# EAGLE design voice boardv1 (EAGLE 6.1)
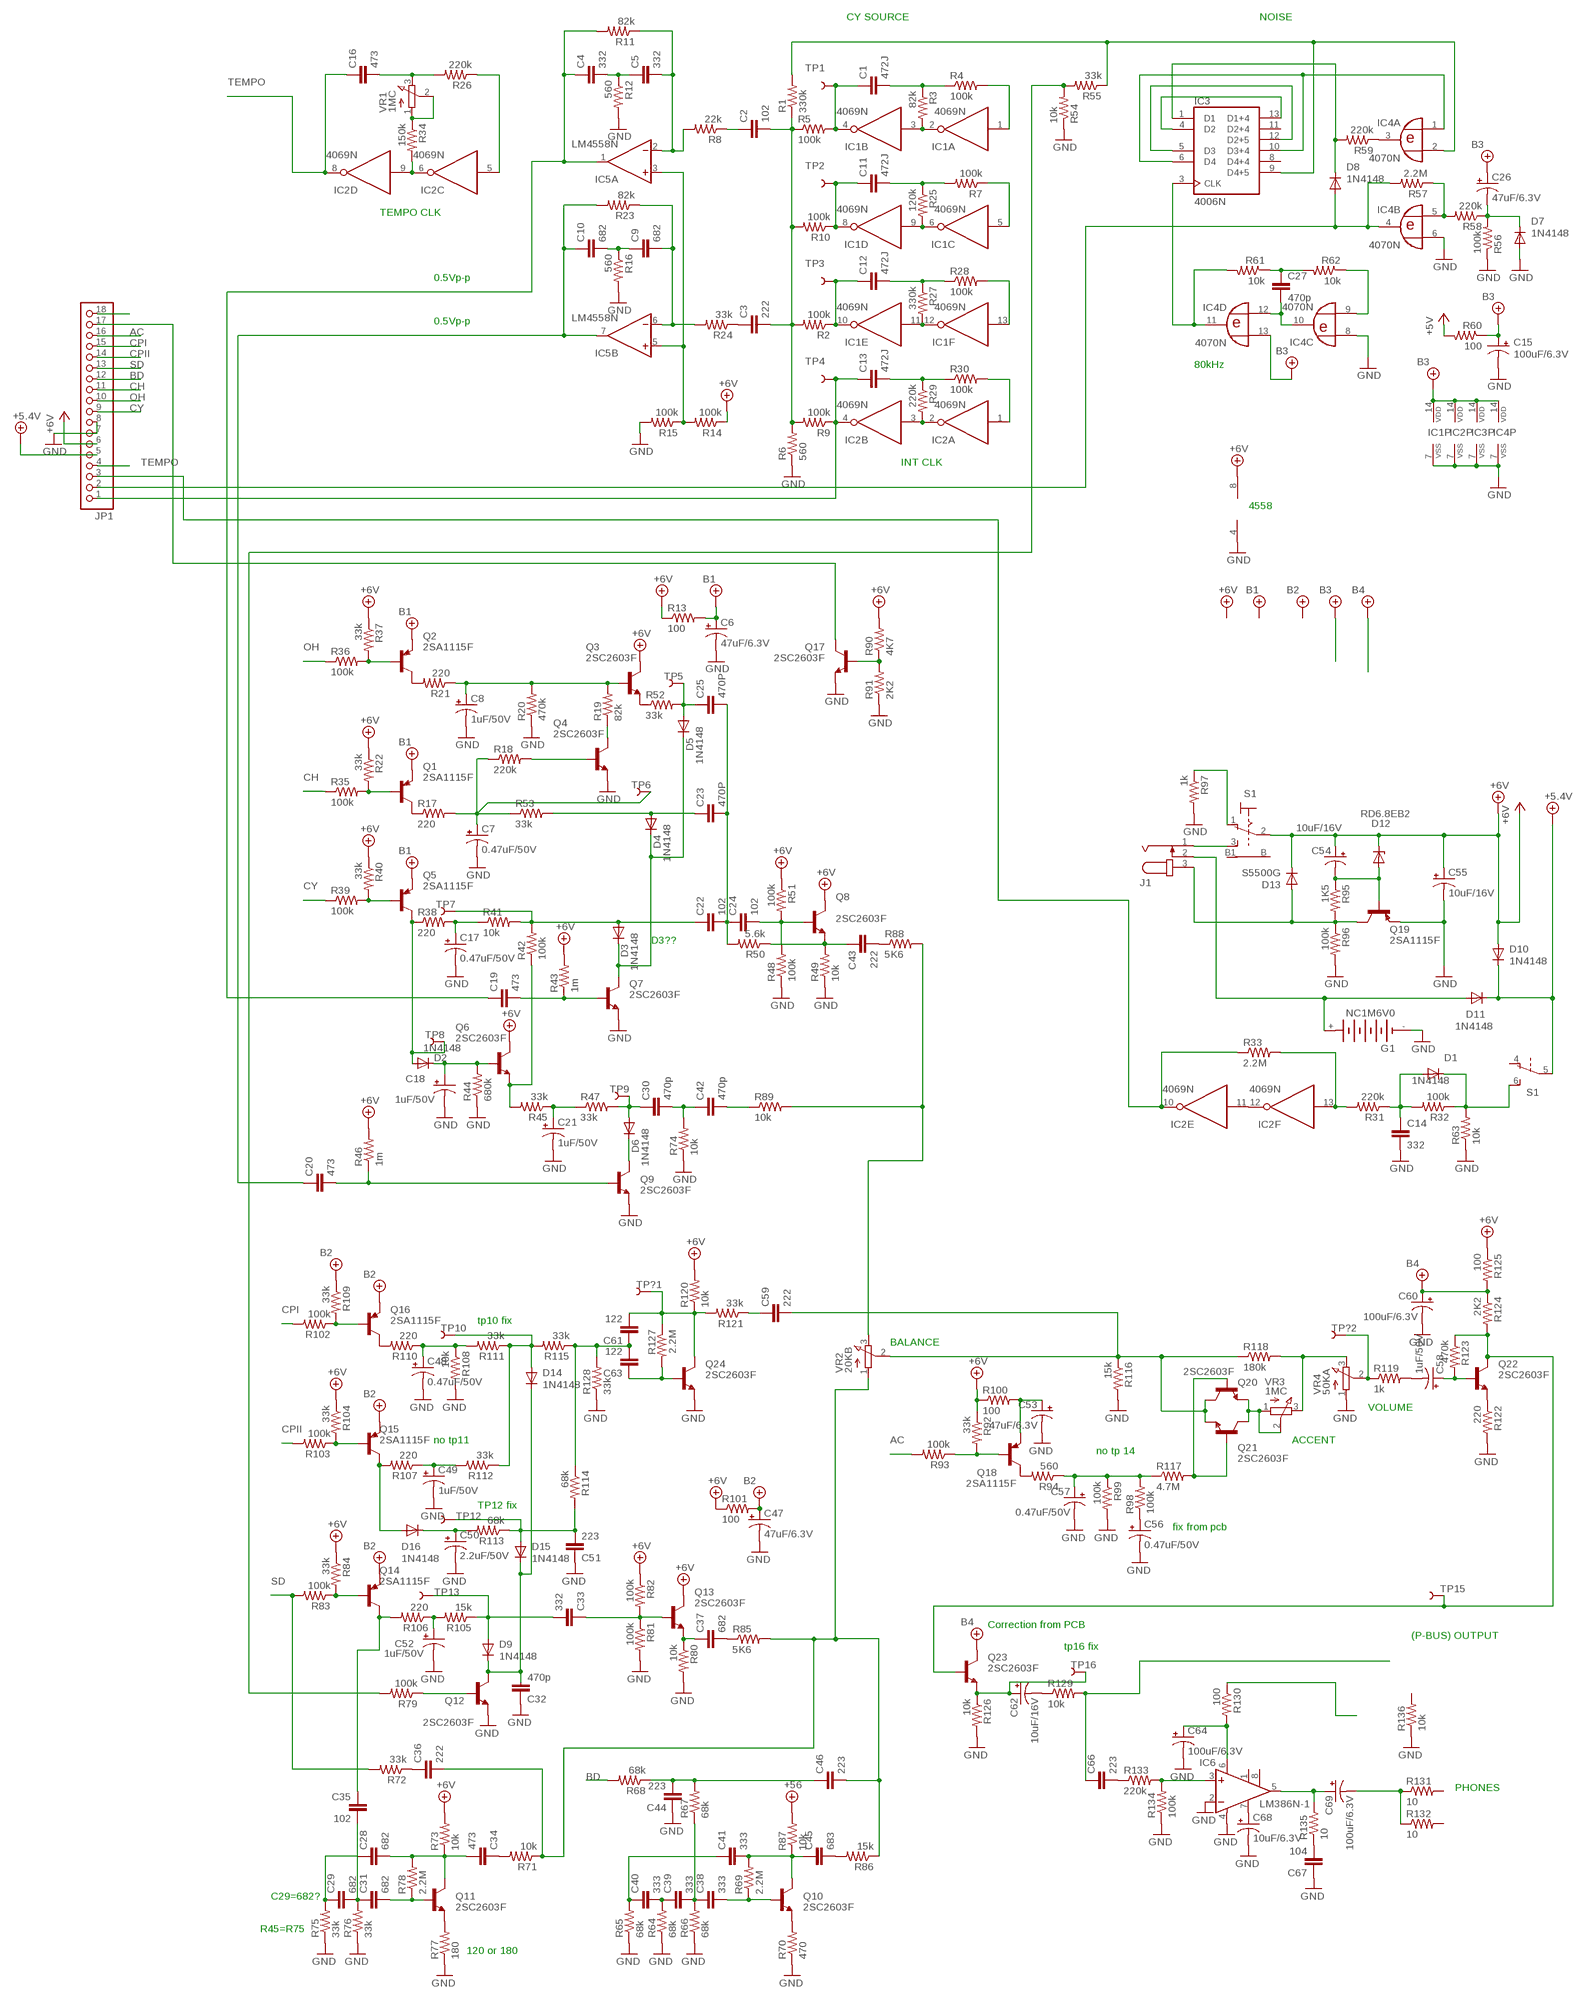
[diagram p0: schematic, sheet 1]

## Parts
C1  472J  C-EU050-024X044  [C050-024X044]
C2  102  C-EU050-024X044  [C050-024X044]
C3  222  C-EU050-024X044  [C050-024X044]
C4  332  C-EU050-024X044  [C050-024X044]
C5  332  C-EU050-024X044  [C050-024X044]
C6  47uF/6.3V  CPOL-USB45181B  [B45181B]
C7  0.47uF/50V  CPOL-USB45181B  [B45181B]
C8  1uF/50V  CPOL-USB45181B  [B45181B]
C9  682  C-EU050-024X044  [C050-024X044]
C10  682  C-EU050-024X044  [C050-024X044]
C11  472J  C-EU050-024X044  [C050-024X044]
C12  472J  C-EU050-024X044  [C050-024X044]
C13  472J  C-EU050-024X044  [C050-024X044]
C14  332  C-EU050-024X044  [C050-024X044]
C15  100uF/6.3V  CPOL-USB45181B  [B45181B]
C16  473  C-EU050-024X044  [C050-024X044]
C17  0.47uF/50V  CPOL-USB45181B  [B45181B]
C18  1uF/50V  CPOL-USB45181B  [B45181B]
C19  473  C-EU050-024X044  [C050-024X044]
C20  473  C-EU050-024X044  [C050-024X044]
C21  1uF/50V  CPOL-USB45181B  [B45181B]
C22  102  C-EU050-024X044  [C050-024X044]
C23  470P  C-EU050-024X044  [C050-024X044]
C24  102  C-EU050-024X044  [C050-024X044]
C25  470P  C-EU050-024X044  [C050-024X044]
C26  47uF/6.3V  CPOL-USB45181B  [B45181B]
C27  470p  C-EU050-024X044  [C050-024X044]
C28  682  C-EU050-024X044  [C050-024X044]
C29  682  C-EU050-024X044  [C050-024X044]
C30  470p  C-EU050-024X044  [C050-024X044]
C31  682  C-EU050-024X044  [C050-024X044]
C32  470p  C-EU050-024X044  [C050-024X044]
C33  332  C-EU050-024X044  [C050-024X044]
C34  473  C-EU050-024X044  [C050-024X044]
C35  102  C-EU050-024X044  [C050-024X044]
C36  222  C-EU050-024X044  [C050-024X044]
C37  682  C-EU050-024X044  [C050-024X044]
C38  333  C-EU050-024X044  [C050-024X044]
C39  333  C-EU050-024X044  [C050-024X044]
C40  333  C-EU050-024X044  [C050-024X044]
C41  333  C-EU050-024X044  [C050-024X044]
C42  470p  C-EU050-024X044  [C050-024X044]
C43  222  C-EU050-024X044  [C050-024X044]
C44  223  C-EU050-024X044  [C050-024X044]
C45  683  C-EU050-024X044  [C050-024X044]
C46  223  C-EU050-024X044  [C050-024X044]
C47  47uF/6.3V  CPOL-USB45181B  [B45181B]
C48  0.47uF/50V  CPOL-USB45181B  [B45181B]
C49  1uF/50V  CPOL-USB45181B  [B45181B]
C50  2.2uF/50V  CPOL-USB45181B  [B45181B]
C51  223  C-EU050-024X044  [C050-024X044]
C52  1uF/50V  CPOL-USB45181B  [B45181B]
C53  47uF/6.3V  CPOL-USB45181B  [B45181B]
C54  10uF/16V  CPOL-USB45181B  [B45181B]
C55  10uF/16V  CPOL-USB45181B  [B45181B]
C56  0.47uF/50V  CPOL-USB45181B  [B45181B]
C57  0.47uF/50V  CPOL-USB45181B  [B45181B]
C58  1uF/50V  CPOL-USB45181B  [B45181B]
C59  222  C-EU050-024X044  [C050-024X044]
C60  100uF/6.3V  CPOL-USB45181B  [B45181B]
C61  122  C-EU050-024X044  [C050-024X044]
C62  10uF/16V  CPOL-USB45181B  [B45181B]
C63  122  C-EU050-024X044  [C050-024X044]
C64  100uF/6.3V  CPOL-USB45181B  [B45181B]
C66  223  C-EU050-024X044  [C050-024X044]
C67  104  C-EU050-024X044  [C050-024X044]
C68  10uF/6.3V  CPOL-USB45181B  [B45181B]
C69  100uF/6.3V  CPOL-USB45181B  [B45181B]
D1  1N4148  DIODE-D-5  [D-5]
D2  1N4148  DIODE-D-5  [D-5]
D3  1N4148  DIODE-D-5  [D-5]
D4  1N4148  DIODE-D-5  [D-5]
D5  1N4148  DIODE-D-5  [D-5]
D6  1N4148  DIODE-D-5  [D-5]
D7  1N4148  DIODE-D-5  [D-5]
D8  1N4148  DIODE-D-5  [D-5]
D9  1N4148  DIODE-D-5  [D-5]
D10  1N4148  DIODE-D-5  [D-5]
D11  1N4148  DIODE-D-5  [D-5]
D12  RD6.8EB2  ZENER-DIODEZD-5  [ZDIO-5]
D13  S5500G  DIODE-D-5  [D-5]
D14  1N4148  DIODE-D-5  [D-5]
D15  1N4148  DIODE-D-5  [D-5]
D16  1N4148  DIODE-D-5  [D-5]
G1  NC1M6V0  [NC1M]
IC1  4069N  [DIL14]
IC2  4069N  [DIL14]
IC3  4006N  [DIL14]
IC4  4070N  [DIL14]
IC5  LM4558N  [DIL08]
IC6  LM386N-1  [DIL08]
J1  JACK-PLUG0  [SPC4077]
JP1  PINHD-1X18  [1X18]
Q1  2SA1115F  -PNP-TO92-ECB  [TO92-ECB]
Q2  2SA1115F  -PNP-TO92-ECB  [TO92-ECB]
Q3  2SC2603F  -NPN-TO92-ECB  [TO92-ECB]
Q4  2SC2603F  -NPN-TO92-ECB  [TO92-ECB]
Q5  2SA1115F  -PNP-TO92-ECB  [TO92-ECB]
Q6  2SC2603F  -NPN-TO92-ECB  [TO92-ECB]
Q7  2SC2603F  -NPN-TO92-ECB  [TO92-ECB]
Q8  2SC2603F  -NPN-TO92-ECB  [TO92-ECB]
Q9  2SC2603F  -NPN-TO92-ECB  [TO92-ECB]
Q10  2SC2603F  -NPN-TO92-ECB  [TO92-ECB]
Q11  2SC2603F  -NPN-TO92-ECB  [TO92-ECB]
Q12  2SC2603F  -NPN-TO92-ECB  [TO92-ECB]
Q13  2SC2603F  -NPN-TO92-ECB  [TO92-ECB]
Q14  2SA1115F  -PNP-TO92-ECB  [TO92-ECB]
Q15  2SA1115F  -PNP-TO92-ECB  [TO92-ECB]
Q16  2SA1115F  -PNP-TO92-ECB  [TO92-ECB]
Q17  2SC2603F  -NPN-TO92-ECB  [TO92-ECB]
Q18  2SA1115F  -PNP-TO92-ECB  [TO92-ECB]
Q19  2SA1115F  -PNP-TO92-ECB  [TO92-ECB]
Q20  2SC2603F  -NPN-TO92-ECB  [TO92-ECB]
Q21  2SC2603F  -NPN-TO92-ECB  [TO92-ECB]
Q22  2SC2603F  -NPN-TO92-ECB  [TO92-ECB]
Q23  2SC2603F  -NPN-TO92-ECB  [TO92-ECB]
Q24  2SC2603F  -NPN-TO92-ECB  [TO92-ECB]
R1  330k  R-US_0204/5  [0204/5]
R2  100k  R-US_0204/5  [0204/5]
R3  82k  R-US_0204/5  [0204/5]
R4  100k  R-US_0204/5  [0204/5]
R5  100k  R-US_0204/5  [0204/5]
R6  560  R-US_0204/5  [0204/5]
R7  100k  R-US_0204/5  [0204/5]
R8  22k  R-US_0204/5  [0204/5]
R9  100k  R-US_0204/5  [0204/5]
R10  100k  R-US_0204/5  [0204/5]
R11  82k  R-US_0204/5  [0204/5]
R12  560  R-US_0204/5  [0204/5]
R13  100  R-US_0204/5  [0204/5]
R14  100k  R-US_0204/5  [0204/5]
R15  100k  R-US_0204/5  [0204/5]
R16  560  R-US_0204/5  [0204/5]
R17  220  R-US_0204/5  [0204/5]
R18  220k  R-US_0204/5  [0204/5]
R19  82k  R-US_0204/5  [0204/5]
R20  470k  R-US_0204/5  [0204/5]
R21  220  R-US_0204/5  [0204/5]
R22  33k  R-US_0204/5  [0204/5]
R23  82k  R-US_0204/5  [0204/5]
R24  33k  R-US_0204/5  [0204/5]
R25  120k  R-US_0204/5  [0204/5]
R26  220k  R-US_0204/5  [0204/5]
R27  330k  R-US_0204/5  [0204/5]
R28  100k  R-US_0204/5  [0204/5]
R29  220k  R-US_0204/5  [0204/5]
R30  100k  R-US_0204/5  [0204/5]
R31  220k  R-US_0204/5  [0204/5]
R32  100k  R-US_0204/5  [0204/5]
R33  2.2M  R-US_0204/5  [0204/5]
R34  150k  R-US_0204/5  [0204/5]
R35  100k  R-US_0204/5  [0204/5]
R36  100k  R-US_0204/5  [0204/5]
R37  33k  R-US_0204/5  [0204/5]
R38  220  R-US_0204/5  [0204/5]
R39  100k  R-US_0204/5  [0204/5]
R40  33k  R-US_0204/5  [0204/5]
R41  10k  R-US_0204/5  [0204/5]
R42  100k  R-US_0204/5  [0204/5]
R43  1m  R-US_0204/5  [0204/5]
R44  680k  R-US_0204/5  [0204/5]
R45  33k  R-US_0204/5  [0204/5]
R46  1m  R-US_0204/5  [0204/5]
R47  33k  R-US_0204/5  [0204/5]
R48  100k  R-US_0204/5  [0204/5]
R49  10k  R-US_0204/5  [0204/5]
R50  5.6k  R-US_0204/5  [0204/5]
R51  100k  R-US_0204/5  [0204/5]
R52  33k  R-US_0204/5  [0204/5]
R53  33k  R-US_0204/5  [0204/5]
R54  10k  R-US_0204/5  [0204/5]
R55  33k  R-US_0204/5  [0204/5]
R56  100k  R-US_0204/5  [0204/5]
R57  2.2M  R-US_0204/5  [0204/5]
R58  220k  R-US_0204/5  [0204/5]
R59  220k  R-US_0204/5  [0204/5]
R60  100  R-US_0204/5  [0204/5]
R61  10k  R-US_0204/5  [0204/5]
R62  10k  R-US_0204/5  [0204/5]
R63  10k  R-US_0204/5  [0204/5]
R64  68k  R-US_0204/5  [0204/5]
R65  68k  R-US_0204/5  [0204/5]
R66  68k  R-US_0204/5  [0204/5]
R67  68k  R-US_0204/5  [0204/5]
R68  68k  R-US_0204/5  [0204/5]
R69  2.2M  R-US_0204/5  [0204/5]
R70  470  R-US_0204/5  [0204/5]
R71  10k  R-US_0204/5  [0204/5]
R72  33k  R-US_0204/5  [0204/5]
R73  10k  R-US_0204/5  [0204/5]
R74  10k  R-US_0204/5  [0204/5]
R75  33k  R-US_0204/5  [0204/5]
R76  33k  R-US_0204/5  [0204/5]
R77  180  R-US_0204/5  [0204/5]
R78  2.2M  R-US_0204/5  [0204/5]
R79  100k  R-US_0204/5  [0204/5]
R80  10k  R-US_0204/5  [0204/5]
R81  100k  R-US_0204/5  [0204/5]
R82  100k  R-US_0204/5  [0204/5]
R83  100k  R-US_0204/5  [0204/5]
R84  33k  R-US_0204/5  [0204/5]
R85  5K6  R-US_0204/5  [0204/5]
R86  15k  R-US_0204/5  [0204/5]
R87  10k  R-US_0204/5  [0204/5]
R88  5K6  R-US_0204/5  [0204/5]
R89  10k  R-US_0204/5  [0204/5]
R90  4K7  R-US_0204/5  [0204/5]
R91  2K2  R-US_0204/5  [0204/5]
R92  33k  R-US_0204/5  [0204/5]
R93  100k  R-US_0204/5  [0204/5]
R94  560  R-US_0204/5  [0204/5]
R95  1K5  R-US_0204/5  [0204/5]
R96  100k  R-US_0204/5  [0204/5]
R97  1k  R-US_0204/5  [0204/5]
R98  100k  R-US_0204/5  [0204/5]
R99  100k  R-US_0204/5  [0204/5]
R100  100  R-US_0204/5  [0204/5]
R101  100  R-US_0204/5  [0204/5]
R102  100k  R-US_0204/5  [0204/5]
R103  100k  R-US_0204/5  [0204/5]
R104  33k  R-US_0204/5  [0204/5]
R105  15k  R-US_0204/5  [0204/5]
R106  220  R-US_0204/5  [0204/5]
R107  220  R-US_0204/5  [0204/5]
R108  10k  R-US_0204/5  [0204/5]
R109  33k  R-US_0204/5  [0204/5]
R110  220  R-US_0204/5  [0204/5]
R111  33k  R-US_0204/5  [0204/5]
R112  33k  R-US_0204/5  [0204/5]
R113  68k  R-US_0204/5  [0204/5]
R114  68k  R-US_0204/5  [0204/5]
R115  33k  R-US_0204/5  [0204/5]
R116  15k  R-US_0204/5  [0204/5]
R117  4.7M  R-US_0204/5  [0204/5]
R118  180k  R-US_0204/5  [0204/5]
R119  1k  R-US_0204/5  [0204/5]
R120  10k  R-US_0204/5  [0204/5]
R121  33k  R-US_0204/5  [0204/5]
R122  220  R-US_0204/5  [0204/5]
R123  470k  R-US_0204/5  [0204/5]
R124  2K2  R-US_0204/5  [0204/5]
R125  100  R-US_0204/5  [0204/5]
R126  10k  R-US_0204/5  [0204/5]
R127  2.2M  R-US_0204/5  [0204/5]
R128  33k  R-US_0204/5  [0204/5]
R129  10k  R-US_0204/5  [0204/5]
R130  100  R-US_0204/5  [0204/5]
R131  10  R-US_0204/5  [0204/5]
R132  10  R-US_0204/5  [0204/5]
R133  220k  R-US_0204/5  [0204/5]
R134  100k  R-US_0204/5  [0204/5]
R135  10  R-US_0204/5  [0204/5]
R136  10k  R-US_0204/5  [0204/5]
S1  9070-2W  [9070-2W]
TP1  TEST-POINT3X5  [PAD.03X.05]
TP2  TEST-POINT3X5  [PAD.03X.05]
TP3  TEST-POINT3X5  [PAD.03X.05]
TP4  TEST-POINT3X5  [PAD.03X.05]
TP5  TEST-POINT3X5  [PAD.03X.05]
TP6  TEST-POINT3X5  [PAD.03X.05]
TP7  TEST-POINT3X5  [PAD.03X.05]
TP8  TEST-POINT3X5  [PAD.03X.05]
TP9  TEST-POINT3X5  [PAD.03X.05]
TP10  TEST-POINT3X5  [PAD.03X.05]
TP12  TEST-POINT3X5  [PAD.03X.05]
TP13  TEST-POINT3X5  [PAD.03X.05]
TP15  TEST-POINT3X5  [PAD.03X.05]
TP16  TEST-POINT3X5  [PAD.03X.05]
TP?1  TEST-POINT3X5  [PAD.03X.05]
TP?2  TEST-POINT3X5  [PAD.03X.05]
VR1  1MC  EVUF2A  [EVUF]
VR2  20KB  EVUF2A  [EVUF]
VR3  1MC  EVUF2A  [EVUF]
VR4  50KA  EVUF2A  [EVUF]

## Nets
+4.1V: D10.C D11.C JP1.5 S1.5(B:P) ; supply symbol labelled +5.4V
+5V: C54.+ C55.+ D10.A D12.C D13.C IC5.8(P:V+) JP1.6 Q3.C Q6.C Q8.C Q13.C R13.1 R14.1 R22.1 R37.1 R40.1 R43.2 R46.2 R51.1 R60.2 R73.2 R82.1 R84.1 R87.2 R90.2 R92.1 R100.1 R101.1 R104.1 R120.2 R125.1 S1.2(1:P) ; supply symbol labelled +6V, +56
+5V/1: C6.+ Q1.E Q2.E Q5.E R13.2 ; supply symbol labelled B1
+5V/2: C47.+ Q14.E Q15.E Q16.E R101.2 R109.1 ; supply symbol labelled B2
+5V/3: C15.+ C26.+ IC1.14(P:VDD) IC2.14(P:VDD) IC3.14(VDD) IC4.13(D:I1) IC4.14(P:VDD) R60.1 ; supply symbol labelled B3
+5V/4: C60.+ Q23.C R124.1 R125.2 ; supply symbol labelled B4
AC: JP1.16 R93.2
BD: JP1.12 R68.2
CH: JP1.11 R35.1
CPI: JP1.15 R102.2
CPII: JP1.14 R103.2
CY: JP1.9 R39.1
GND: C6.- C7.- C8.- C14.2 C15.- C17.- C18.- C21.- C32.1 C44.1 C47.- C48.- C49.- C50.- C51.1 C52.- C53.- C55.- C56.- C57.- C60.- C64.- C67.1 C68.- D7.A G1.- IC1.7(P:VSS) IC2.7(P:VSS) IC3.7(VSS) IC4.6(B:I1) IC4.7(P:VSS) IC4.8(C:I0) IC5.4(P:V-) IC6.2(-IN) IC6.4(GND) JP1.7 JP1.8 Q4.E Q7.E Q9.E Q12.E Q17.E Q19.E Q24.E R6.1 R12.2 R15.2 R16.2 R20.1 R44.1 R48.1 R49.1 R54.1 R56.1 R63.1 R64.1 R65.1 R66.1 R70.1 R74.1 R75.1 R76.1 R77.1 R80.2 R81.2 R91.1 R96.2 R97.2 R99.2 R108.2 R116.2 R122.2 R126.2 R128.1 R134.1 R136.1 VR4.1(A)
N$1: IC1.2(A:O) IC1.3(B:I) R3.2
N$2: IC1.6(C:O) IC1.9(D:I) R25.2
N$3: IC1.11(E:I) IC1.12(F:O) R27.2
N$4: IC2.2(A:O) IC2.3(B:I) R29.2
N$5: IC2.6(C:O) IC2.9(D:I) R34.2
N$6: IC2.11(E:I) IC2.12(F:O)
N$7: C12.1 IC1.10(E:O) R2.1 TP3.P$1
N$8: C1.2 R3.1 R4.1
N$9: C1.1 IC1.4(B:O) R5.2 TP1.P$1
N$10: C13.1 IC2.4(B:O) JP1.1 R9.1 TP4.P$1
N$11: C11.1 IC1.8(D:O) R10.1 TP2.P$1
N$12: C2.2 C3.2 R1.1 R2.2 R5.1 R6.2 R9.2 R10.2
N$13: IC1.1(A:I) R4.2
N$14: IC1.5(C:I) R7.1
N$15: IC1.13(F:I) R28.2
N$16: C5.2 IC5.2(A:-IN) R8.2 R11.1
N$17: C4.1 C19.1 IC5.1(A:OUT) R11.2
N$18: C4.2 C5.1 R12.1
N$19: IC5.3(A:+IN) IC5.5(B:+IN) R14.2 R15.1
N$20: C2.1 R8.1
N$21: C7.+ R17.2 R18.1 R53.1 TP6.P$1
N$22: C8.+ Q3.B R19.2 R20.2 R21.1
N$23: Q4.B R18.2
N$24: Q4.C R19.1
N$25: Q2.C R21.2
N$26: Q1.C R17.1
N$27: Q1.B R22.2 R35.2
N$28: C9.1 C10.2 R16.1
N$29: C3.1 R24.1
N$30: C10.1 C20.1 IC5.7(B:OUT) R23.2
N$31: C9.2 IC5.6(B:-IN) R23.1 R24.2
N$32: C12.2 R27.1 R28.1
N$33: C11.2 R7.2 R25.1
N$34: C13.2 R29.1 R30.1
N$35: IC2.1(A:I) R30.2
N$36: C14.1 D1.A R31.1 R32.2
N$37: IC2.5(C:I) R26.1
N$38: C16.2 R26.2 VR1.3(E)
N$39: IC3.9(D4+5) IC4.2(A:I1) R1.2 R55.1
N$40: IC3.4(D2) IC3.13(D1+4)
N$41: IC3.6(D4) IC3.10(D3+4) IC4.1(A:I0)
N$42: IC3.5(D3) IC3.12(D2+5)
N$43: D8.C IC3.1(D1) R59.2
N$44: D1.C R32.1 R63.2 S1.6(B:S)
N$45: IC3.3(CLK) IC4.11(D:O) R61.2
N$46: JP1.18
N$47: C18.+ D2.C Q6.B R44.2
N$48: D2.A Q5.C R38.1 TP8.P$1
N$49: C19.2 Q7.B R43.1
N$50: C20.2 Q9.B R46.1
N$51: C22.2 C23.2 C24.1 C25.2 R50.2
N$52: IC2.13(F:I) R31.2 R33.2
N$53: IC2.10(E:O) JP1.3 R33.1
N$54: R34.1 VR1.1(A) VR1.2(S)
N$55: Q2.B R36.2 R37.2
N$56: Q5.B R39.2 R40.2
N$57: C17.+ R38.2 R41.1
N$58: C22.1 D3.A R41.2 R42.2 TP7.P$1
N$59: Q6.E R42.1 R45.2
N$60: C21.+ R45.1 R47.1
N$61: C24.2 Q8.B R48.2 R51.2
N$62: D3.C D4.C D5.C Q7.C
N$63: C23.1 D4.A R53.2
N$64: C25.1 D5.A R52.2 TP5.P$1
N$65: C43.1 Q8.E R49.2 R50.1
N$66: Q3.E R52.1
N$67: C30.1 D6.A R47.2 TP9.P$1
N$68: D6.C Q9.C
N$69: R54.2 R55.2 R79.2
N$70: IC4.5(B:I0) R57.1 R58.2
N$71: C26.- D7.C R56.2 R58.1
N$72: D8.A IC4.4(B:O) JP1.2 R57.2
N$73: C38.2 Q10.B R69.1
N$74: IC4.3(A:O) R59.1
N$75: C27.1 R61.1 R62.2
N$76: IC4.9(C:I1) R62.1
N$77: C27.2 IC4.10(C:O) IC4.12(D:I0)
N$78: Q10.E R70.2
N$79: C41.2 C45.1 Q10.C R69.2 R87.1
N$80: C38.1 C39.2 R66.2 R67.1
N$81: C44.2 C46.1 R67.2 R68.1
N$82: C31.2 Q11.B R78.1
N$83: C29.2 C31.1 C35.2 R76.2
N$84: C28.1 C29.1 R75.2
N$85: C40.1 C41.1 R65.2
N$86: C32.2 D9.C D14.C D15.C Q12.C
N$87: C42.2 R89.1
N$88: C37.1 Q13.E R80.1
N$89: C39.1 C40.2 R64.2
N$90: C34.1 R71.2
N$91: Q12.B R79.1
N$92: C36.1 R72.1
N$93: C56.+ R98.1
N$94: C30.2 C42.1 R74.2
N$95: Q11.E R77.2
N$96: C28.2 C34.2 Q11.C R73.1 R78.2
N$97: C36.2 C46.2 R71.1 R85.2 R86.1 VR2.1(A)
N$98: JP1.17 Q17.C
N$99: C33.1 Q13.B R81.1 R82.2
N$100: R88.2 R89.2 VR2.3(E)
N$101: Q14.B R83.1 R84.2
N$102: C35.1 Q14.C R106.2
N$103: C33.2 D9.A R105.1 TP13.P$1
N$104: C37.2 R85.1
N$105: C45.2 R86.2
N$106: C43.2 R88.1
N$107: Q17.B R90.1 R91.2
N$108: Q18.B R92.2 R93.1
N$109: Q18.C R94.2
N$110: C53.+ Q18.E R100.2
N$111: R118.2 VR3.3(E) VR4.3(E)
N$112: D13.A J1.3 Q19.C R95.2 R96.1
N$113: D11.A G1.+ J1.2
N$114: C54.- D12.A Q19.B R95.1
N$115: R97.1 S1.1(1:O)
N$116: J1.1 S1.3(1:S)
N$117: C57.+ R94.1 R98.2 R99.1 R117.1
N$118: Q15.B R103.1 R104.2
N$119: Q16.B R102.1 R109.2
N$120: C52.+ R105.2 R106.1
N$121: D16.A Q15.C R107.2
N$122: Q16.C R110.2
N$123: C48.+ R108.1 R110.1 R111.2
N$124: C49.+ R107.1 R112.2
N$125: D14.A R111.1 R112.1 R115.2 TP10.P$1
N$126: C61.1 C63.2 R114.1 R115.1 R128.2
N$127: C50.+ D16.C R113.2
N$128: C51.2 D15.A R113.1 R114.2 TP12.P$1
N$129: Q20.B Q21.B R117.2
N$130: C59.2 Q20.C Q21.E R116.1 R118.1 VR2.2(S)
N$131: Q20.E Q21.C VR3.1(A) VR3.2(S)
N$132: R119.1 TP?2.P$1 VR4.2(S)
N$133: C61.2 Q24.C R120.1 R121.2 R127.1 TP?1.P$1
N$134: Q22.E R122.1
N$135: Q22.C Q23.B R123.1 R124.2 TP15.P$1
N$137: C58.+ Q22.B R123.2
N$138: C62.+ Q23.E R126.1 TP16.P$1
N$139: C68.+ IC6.7(BYPASS)
N$140: C63.1 Q24.B R127.2
N$141: C58.- R119.2
N$142: C59.1 R121.1
N$143: C62.- R129.1
N$144: C66.1 R129.2
N$145: C64.+ IC6.6(VS) R130.2
N$146: C69.+ IC6.5(OUT) R135.2
N$147: R130.1
N$148: C69.- R131.1 R132.1
N$149: IC6.3(+IN) R133.2 R134.2
N$150: C66.2 R133.1
N$151: C67.2 R135.1
OH: JP1.10 R36.1
SD: JP1.13 R72.2 R83.2
TEMPO: C16.1 IC2.8(D:O) JP1.4
Unconnected: IC3.8(D4+4) IC3.11(D2+4) IC6.1(GAIN) IC6.8(GAIN) R131.2 R132.2 R136.2 S1.4(B:O) S1.B1(1:B1) S1.B(1:B)

## Notes on the sheet
- CY SOURCE | NOISE
- TEMPO CLK
- 0.5Vp-p
- 0.5Vp-p
- 80kHz
- INT CLK
- 4558
- D3??
- tp10 fix
- BALANCE
- VOLUME
- no tp11 | ACCENT
- no tp 14
- TP12 fix
- fix from pcb
- Correction from PCB
- (P-BUS) OUTPUT
- tp16 fix
- PHONES
- C29=682?
- R45=R75
- 120 or 180

## Library data of the parts
C1-C5 C9-C14 C16 C19 C20 C22-C25 C27-C46 C51 C59 C61 C63 C66 C67 = rcl:C-EU: CAPACITOR, European symbol
C6-C8 C15 C17 C18 C21 C26 C47-C50 C52-C58 C60 C62 C64 C68 C69 = rcl:CPOL-US: POLARIZED CAPACITOR, American symbol
D1-D11 D13-D16 = diode:DIODE-: DIODE
D12 = diode:ZENER-DIODE: Z-Diode
G1 = battery:NC1M6V0: NC ACCU Sonnenschein Mini-Memo NC-M 6.0V R5
IC1 IC2 = 40xx:4069: Hex INVERTER
IC3 = 40xx:4006: 18-bit static SHIFT REGISTER
IC4 = 40xx:4070: Quad 2-input XOR
IC5 = linear:*4558: OP AMP
IC6 = linear:LM386?-*: Low Voltage Audio Power Amplifier Source: http://cache.national.com/ds/LM/LM386.pdf
J1 = con-jack:JACK-PLUG: DC POWER JACK Power Jack, DC, Right Angle, Through Hole, Rated 5A at 16VDC, PC Terminals Distributor: Farnell (www.Farnell.de) Drawing: 84N1161.pdf / 84N1162.pdf Manufacturer: SPC Technology (www.spctechnology.com) Type: SPC4077 / SPC 4078; OC_FARNELL: unknown; OC_NEWARK: unknown
JP1 = adafruit:PINHD-1X18: PIN HEADER
Q1 Q2 Q5 Q14-Q16 Q18 Q19 = transistor-neu-to92:*-PNP-: PNP Transistror
Q3 Q4 Q6-Q13 Q17 Q20-Q24 = transistor:*-NPN-: NPN Transistror BF959 corrected 2008.03.06
R1-R136 = rcl:R-US_: RESISTOR, American symbol
S1 = switch:9070-2W: TOGGLE SWITCH Marquardt
TP1-TP10 TP12 TP13 TP15 TP16 TP?1 TP?2 = SparkFun-Passives:TEST-POINT: Bare copper test points for troubleshooting or ICT
VR1-VR4 = pot:EVU: 9 mm Square Rotary Potentiometers Source: Panasonic

## Board
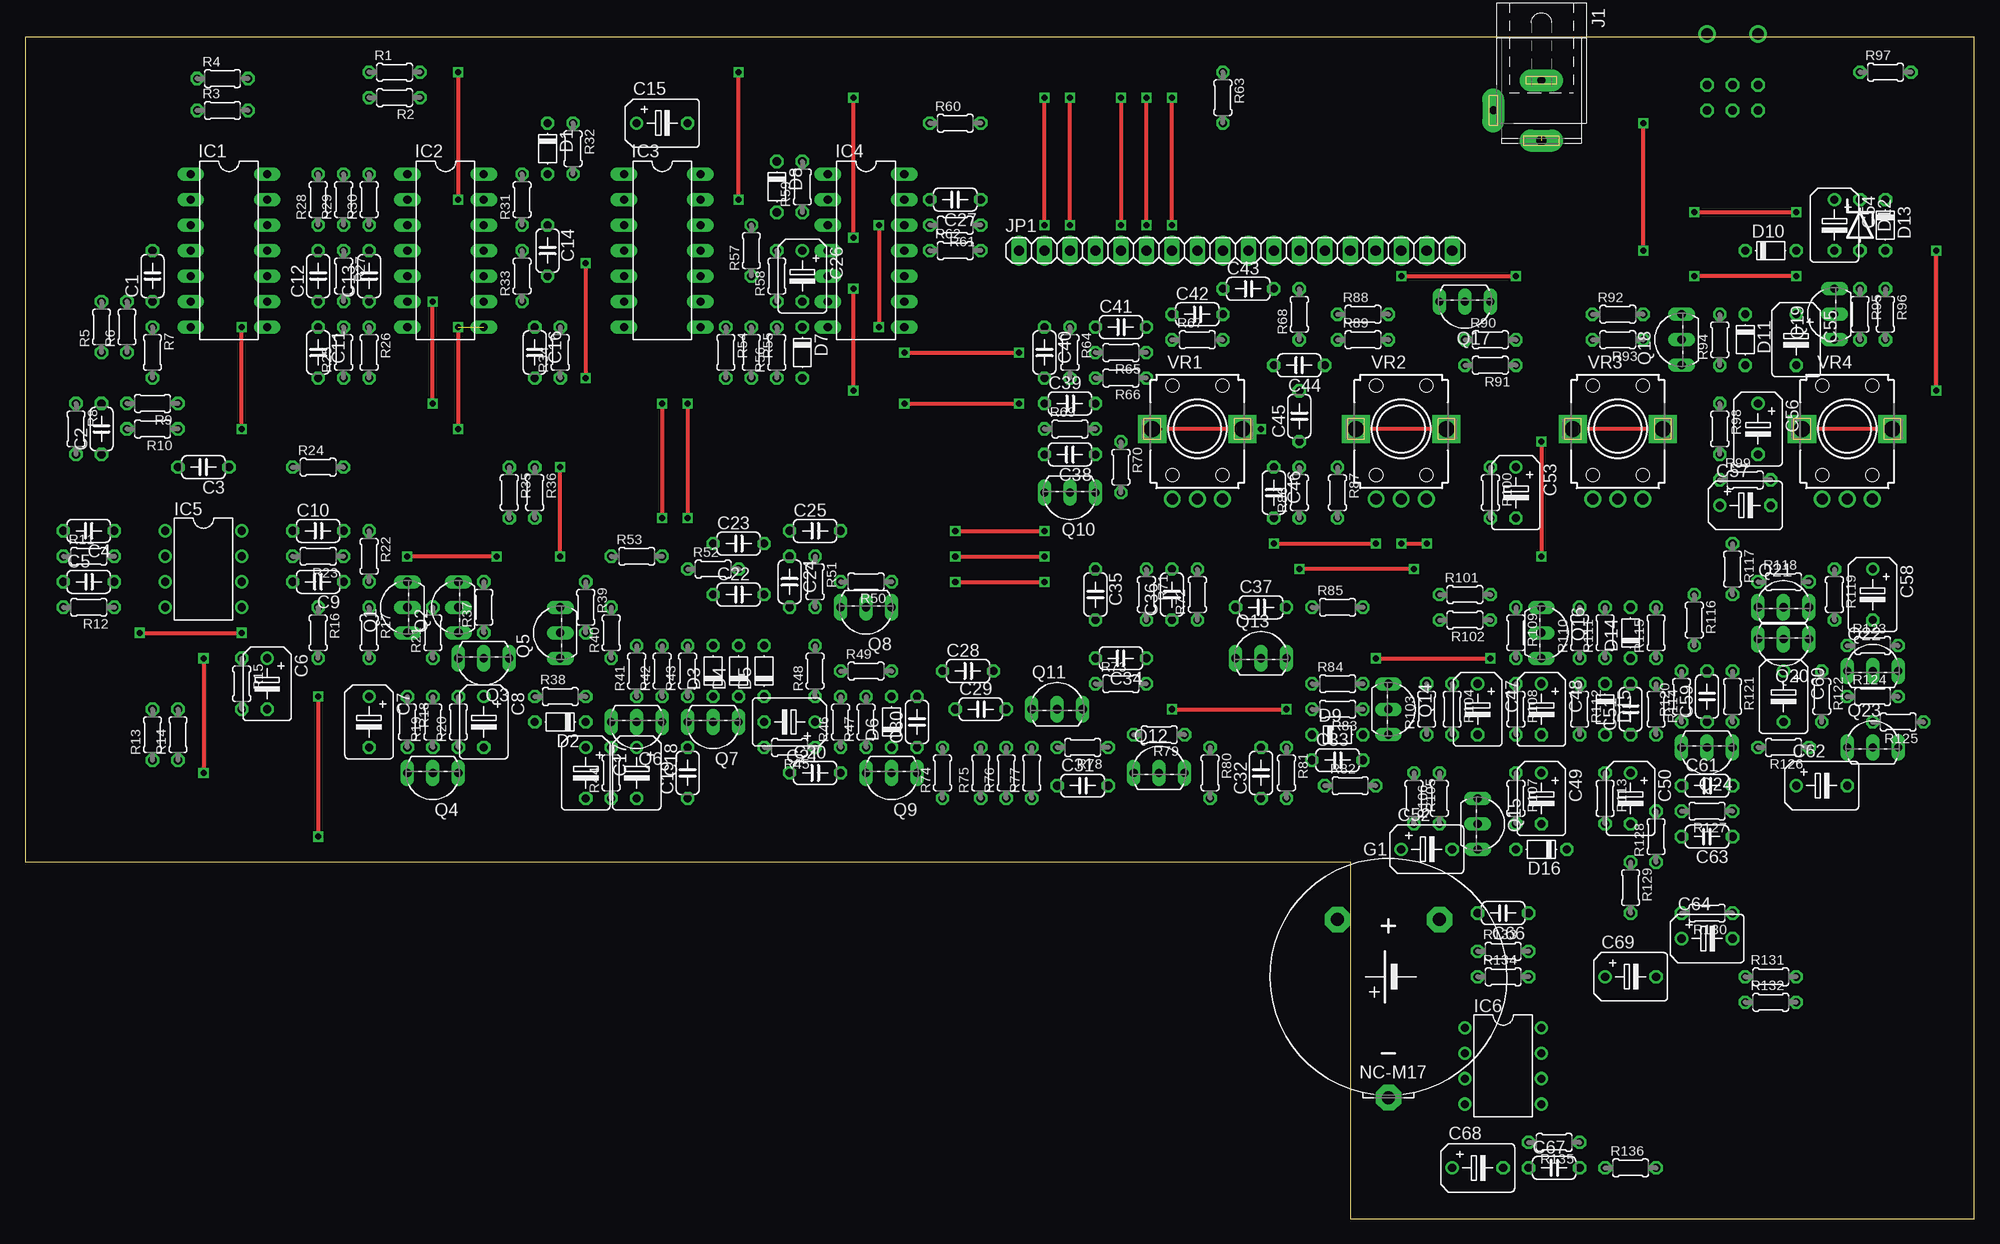
[diagram p1: board, top side]
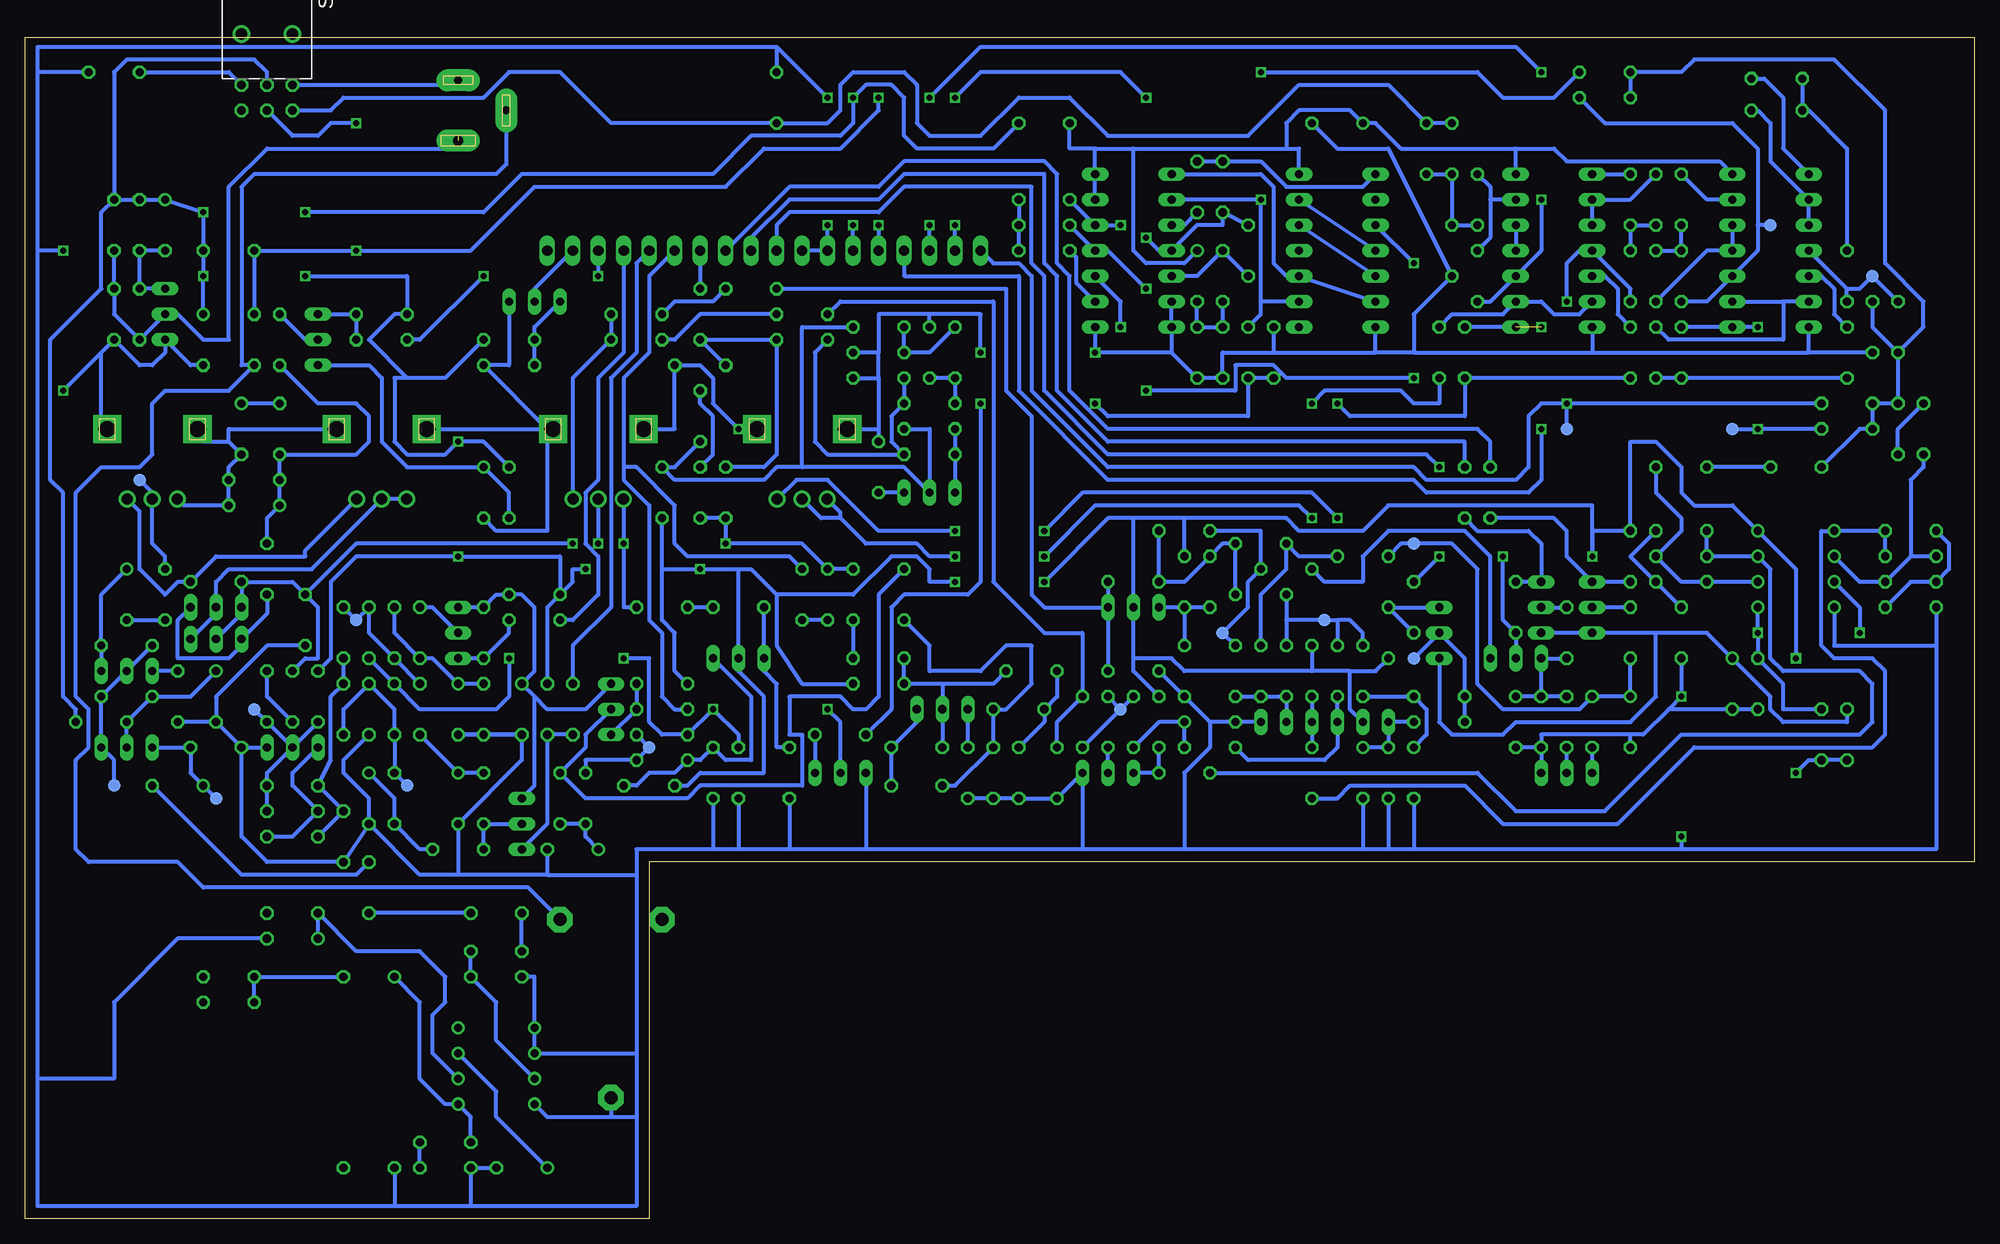
[diagram p2: board, bottom side, seen from below]

Size 194.29 x 117.78 mm. Coordinates in mm from the lower left corner, seen from the top.
Outline: 0,35.56 132.08,35.56 132.08,0 194.29,0 194.29,117.78 0,117.78 0,35.56
Copper layers (1*16): Top 0.035mm / dielectric 1.5mm / Bottom 0.035mm
Design rules: minimum track width 10mil, minimum drill 24mil, track to track 8mil, track to pad 8mil, pad to pad 8mil, via to via 8mil, smd to smd 8mil, copper to edge 40mil, drill to drill 8mil, minimum pad ring 10mil, minimum via ring 8mil, stop-mask expansion 4mil, vias tented up to drill 0mil, thermal gap 10mil

### Footprints (pad centres in the part's own frame; a part is rotated, then mirrored left to right if it is on the bottom)
C050-024X044 = drill 0.813 octagon: 1 -2.54,0; 2 2.54,0
B45181B = drill 0.813: + -2.54,0 | drill 0.813 octagon: - 2.54,0
D-5 = drill 0.813 octagon: A 2.54,0; C -2.54,0
ZDIO-5 = drill 0.813 octagon: A 2.54,0; C -2.54,0
NC1M = drill 1.321 pad 2.54 octagon: + 5.08,5.715; +@1 -5.08,5.715; - 0,-12.065
DIL14 = drill 0.813 long: 1 -7.62,-3.81; 2 -5.08,-3.81; 3 -2.54,-3.81; 4 0,-3.81; 5 2.54,-3.81; 6 5.08,-3.81; 7 7.62,-3.81; 8 7.62,3.81; 9 5.08,3.81; 10 2.54,3.81; 11 0,3.81; 12 -2.54,3.81; 13 -5.08,3.81; 14 -7.62,3.81
DIL08 = drill 0.813 pad 1.27: 1 -3.81,-3.81; 2 -1.27,-3.81; 3 1.27,-3.81; 4 3.81,-3.81; 5 3.81,3.81; 6 1.27,3.81; 7 -1.27,3.81; 8 -3.81,3.81
SPC4077 = drill 0.8 pad 2.184 long: 1 -3,0; 2 0,-4.8 | drill 1 pad 2.184 long: 3 3,0
1X18 = drill 1.016 long: 1 -21.59,0; 2 -19.05,0; 3 -16.51,0; 4 -13.97,0; 5 -11.43,0; 6 -8.89,0; 7 -6.35,0; 8 -3.81,0; 9 -1.27,0; 10 1.27,0; 11 3.81,0; 12 6.35,0; 13 8.89,0; 14 11.43,0; 15 13.97,0; 16 16.51,0; 17 19.05,0; 18 21.59,0
TO92-ECB = drill 0.813 long: B 2.54,0; C 0,0; E -2.54,0
0204/5 = drill 0.813 octagon: 1 -2.54,0; 2 2.54,0
9070-2W = drill 0.813 octagon: 1 5.08,-2.54; 2 5.08,0; 3 5.08,2.54; 4 7.62,-2.54; 5 7.62,0; 6 7.62,2.54 | drill 1.118 pad 1.778: B 0,-2.54; B1 0,2.54
PAD.03X.05 = smd 1.27 x 1.27: P$1 0,0
EVUF = drill 1.1 pad 1.676: 1 -2.5,-7; 2 0,-7; 3 2.5,-7 | drill 1.6 pad 2.8 square: M1 4.5,0; M2 -4.5,0

### Placement (x,y rotation side)
C1  12.7,93.98 90 top
C2  7.62,78.74 90 top
C3  17.78,74.93 180 top
C4  6.35,68.58 180 top
C5  6.35,63.5 0 top
C6  24.13,53.34 270 top
C7  34.29,49.53 270 top
C8  45.72,49.53 270 top
C9  29.21,63.5 180 top
C10  29.21,68.58 0 top
C11  29.21,86.36 270 top
C12  29.21,93.98 90 top
C13  34.29,93.98 90 top
C14  52.07,96.52 270 top
C15  63.5,109.22 0 top
C16  50.8,86.36 270 top
C17  55.88,44.45 270 top
C18  60.96,44.45 270 top
C19  66.04,44.45 90 top
C20  78.74,44.45 0 top
C21  76.2,49.53 180 top
C22  71.12,62.23 0 top
C23  71.12,67.31 0 top
C24  76.2,63.5 270 top
C25  78.74,68.58 0 top
C26  77.47,93.98 270 top
C27  92.71,101.6 180 top
C28  93.98,54.61 0 top
C29  95.25,50.8 0 top
C30  88.9,49.53 90 top
C31  105.41,43.18 0 top
C32  123.19,44.45 90 top
C33  130.81,45.72 0 top
C34  109.22,55.88 180 top
C35  106.68,62.23 270 top
C36  114.3,62.23 90 top
C37  123.19,60.96 0 top
C38  104.14,76.2 180 top
C39  104.14,81.28 0 top
C40  101.6,86.36 270 top
C41  109.22,88.9 0 top
C42  116.84,90.17 0 top
C43  121.92,92.71 0 top
C44  127,85.09 180 top
C45  127,80.01 90 top
C46  124.46,72.39 270 top
C47  144.78,50.8 270 top
C48  151.13,50.8 270 top
C49  151.13,41.91 270 top
C50  160.02,41.91 270 top
C51  160.02,50.8 90 top
C52  139.7,36.83 0 top
C53  148.59,72.39 270 top
C54  180.34,99.06 270 top
C55  176.53,87.63 270 top
C56  172.72,78.74 270 top
C57  171.45,71.12 0 top
C58  184.15,62.23 270 top
C59  167.64,52.07 90 top
C60  175.26,52.07 270 top
C61  167.64,43.18 0 top
C62  179.07,43.18 0 top
C63  167.64,38.1 180 top
C64  167.64,27.94 0 top
C66  147.32,30.48 180 top
C67  152.4,5.08 0 top
C68  144.78,5.08 0 top
C69  160.02,24.13 0 top
D1  52.07,106.68 270 top
D2  53.34,49.53 180 top
D3  68.58,54.61 90 top
D4  71.12,54.61 90 top
D5  73.66,54.61 90 top
D6  86.36,49.53 90 top
D7  77.47,86.36 270 top
D8  74.93,102.87 270 top
D9  130.81,48.26 0 top
D10  173.99,96.52 0 top
D11  171.45,87.63 270 top
D12  182.88,99.06 270 top
D13  185.42,99.06 270 top
D14  160.02,58.42 90 top
D15  157.48,50.8 270 top
D16  151.13,36.83 180 top
G1  135.89,24.13 0 top
IC1  20.32,96.52 270 top
IC2  41.91,96.52 270 top
IC3  63.5,96.52 270 top
IC4  83.82,96.52 270 top
IC5  17.78,64.77 270 top
IC6  147.32,15.24 270 top
J1  151.13,110.49 270 top
JP1  120.65,96.52 0 top
Q1  38.1,60.96 90 top
Q2  43.18,60.96 90 top
Q3  45.72,55.88 180 top
Q4  40.64,44.45 180 top
Q5  53.34,58.42 90 top
Q6  60.96,49.53 180 top
Q7  68.58,49.53 180 top
Q8  83.82,60.96 180 top
Q9  86.36,44.45 180 top
Q10  104.14,72.39 180 top
Q11  102.87,50.8 0 top
Q12  113.03,44.45 0 top
Q13  123.19,55.88 0 top
Q14  135.89,50.8 270 top
Q15  144.78,39.37 270 top
Q16  151.13,58.42 270 top
Q17  143.51,91.44 180 top
Q18  165.1,87.63 90 top
Q19  180.34,90.17 90 top
Q20  175.26,57.78 180 top
Q21  175.26,60.96 0 top
Q22  184.15,54.61 0 top
Q23  184.15,46.99 0 top
Q24  167.64,46.99 180 top
R1  36.83,114.3 0 top
R2  36.83,111.76 180 top
R3  19.68,110.49 0 top
R4  19.68,113.67 0 top
R5  7.62,88.9 90 top
R6  10.16,88.9 90 top
R7  12.7,86.36 270 top
R8  5.08,78.74 270 top
R9  12.7,81.28 180 top
R10  12.7,78.74 180 top
R11  6.35,66.04 0 top
R12  6.35,60.96 180 top
R13  12.7,48.26 90 top
R14  15.24,48.26 90 top
R15  21.59,53.34 270 top
R16  29.21,58.42 270 top
R17  34.29,58.42 270 top
R18  38.1,49.53 270 top
R19  40.64,49.53 90 top
R20  43.18,49.53 90 top
R21  40.64,58.42 90 top
R22  34.29,66.04 270 top
R23  29.21,66.04 180 top
R24  29.21,74.93 0 top
R25  31.75,86.36 90 top
R26  34.29,86.36 270 top
R27  31.75,93.98 270 top
R28  29.21,101.6 90 top
R29  31.75,101.6 90 top
R30  34.29,101.6 90 top
R31  49.53,101.6 90 top
R32  54.61,106.68 270 top
R33  49.53,93.98 90 top
R34  53.34,86.36 90 top
R35  48.26,72.39 270 top
R36  50.8,72.39 270 top
R37  45.72,60.96 90 top
R38  53.34,52.07 0 top
R39  55.88,60.96 270 top
R40  58.42,58.42 90 top
R41  60.96,54.61 90 top
R42  63.5,54.61 90 top
R43  66.04,54.61 90 top
R44  58.42,44.45 90 top
R45  76.2,46.99 180 top
R46  81.28,49.53 90 top
R47  83.82,49.53 90 top
R48  78.74,54.61 90 top
R49  83.82,54.61 0 top
R50  83.82,63.5 180 top
R51  78.74,63.5 270 top
R52  68.58,64.77 0 top
R53  60.96,66.04 0 top
R54  69.85,86.36 270 top
R55  72.39,86.36 270 top
R56  74.93,86.36 90 top
R57  72.39,96.52 90 top
R58  74.93,93.98 90 top
R59  77.47,102.87 90 top
R60  92.71,109.22 0 top
R61  92.71,99.06 180 top
R62  92.71,96.52 0 top
R63  119.38,111.76 270 top
R64  104.14,86.36 270 top
R65  109.22,86.36 180 top
R66  109.22,83.82 180 top
R67  116.84,87.63 0 top
R68  127,90.17 90 top
R69  104.14,78.74 0 top
R70  109.22,74.93 270 top
R71  111.76,62.23 270 top
R72  116.84,62.23 90 top
R73  109.22,53.34 0 top
R74  91.44,44.45 90 top
R75  95.25,44.45 90 top
R76  97.79,44.45 90 top
R77  100.33,44.45 90 top
R78  105.41,46.99 180 top
R79  113.03,48.26 180 top
R80  118.11,44.45 270 top
R81  125.73,44.45 270 top
R82  132.08,43.18 0 top
R83  130.81,50.8 180 top
R84  130.81,53.34 0 top
R85  130.81,60.96 0 top
R86  127,72.39 90 top
R87  130.81,72.39 270 top
R88  133.35,90.17 0 top
R89  133.35,87.63 0 top
R90  146.05,87.63 0 top
R91  146.05,85.09 180 top
R92  158.75,90.17 0 top
R93  158.75,87.63 180 top
R94  168.91,87.63 90 top
R95  182.88,90.17 270 top
R96  185.42,90.17 270 top
R97  185.42,114.3 0 top
R98  168.91,78.74 270 top
R99  171.45,73.66 0 top
R100  146.05,72.39 270 top
R101  143.51,62.23 0 top
R102  143.51,59.69 180 top
R103  139.7,50.8 90 top
R104  142.24,50.8 270 top
R105  138.43,41.91 270 top
R106  140.97,41.91 90 top
R107  148.59,41.91 270 top
R108  148.59,50.8 270 top
R109  148.59,58.42 270 top
R110  154.94,58.42 90 top
R111  157.48,58.42 90 top
R112  154.94,50.8 270 top
R113  157.48,41.91 270 top
R114  162.56,50.8 270 top
R115  162.56,58.42 90 top
R116  166.37,59.69 270 top
R117  170.18,64.77 270 top
R118  175.26,63.5 0 top
R119  180.34,62.23 270 top
R120  165.1,52.07 90 top
R121  170.18,52.07 270 top
R122  179.07,52.07 270 top
R123  184.15,57.15 0 top
R124  184.15,52.07 0 top
R125  186.69,49.53 180 top
R126  175.26,46.99 180 top
R127  167.64,40.64 180 top
R128  162.56,38.1 90 top
R129  160.02,33.02 270 top
R130  167.64,30.48 180 top
R131  173.99,24.13 0 top
R132  173.99,21.59 0 top
R133  147.32,26.67 0 top
R134  147.32,24.13 0 top
R135  152.4,7.62 180 top
R136  160.02,5.08 0 top
S1  170.18,118.11 270 bottom
TP1  10.16,93.98 0 bottom
TP2  24.13,78.74 0 bottom
TP3  20.32,99.06 0 bottom
TP4  40.64,78.74 0 bottom
TP5  74.93,58.42 270 bottom
TP6  55.88,67.31 270 bottom
TP7  64.77,59.69 270 bottom
TP8  55.88,55.88 270 bottom
TP9  85.09,50.8 270 bottom
TP10  161.29,59.69 270 bottom
TP12  156.21,43.18 270 bottom
TP13  132.08,46.99 270 bottom
TP15  185.42,43.18 270 bottom
TP16  175.26,41.91 270 bottom
TP?1  171.45,50.8 0 bottom
TP?2  182.88,73.66 0 bottom
VR1  116.84,78.74 0 top
VR2  137.16,78.74 0 top
VR3  158.75,78.74 0 top
VR4  181.61,78.74 0 top

### Tracks (layer width: path | path; a pad name or v marks a point on that pad's centre or on a via)
+4.1V  (via drill 0.6)
  Top 0.406: v161.29,96.52 v161.29,109.22 | v109.22,111.76 v109.22,99.06
  Bottom 0.406: v161.29,109.22 163.83,109.22 165.1,107.95 167.64,107.95 S1.5 | D11.C D10.C v161.29,96.52 149.86,96.52 143.51,102.87 124.46,102.87 120.65,106.68 113.03,106.68 109.22,110.49 v109.22,111.76 | v109.22,99.06 JP1.5
+5V  (via drill 0.6)
  Top 0.406: v17.78,55.88 v17.78,44.45 | v138.43,64.77 v127,64.77 | v151.13,77.47 v151.13,66.04 | v166.37,100.33 v176.53,100.33 | v46.99,66.04 v38.1,66.04 | v92.71,63.5 v101.6,63.5 | v176.53,93.98 v166.37,93.98 | v111.76,99.06 v111.76,111.76
  Bottom 0.406: v17.78,55.88 17.78,64.77 IC5.8 24.13,71.12 27.94,71.12 29.21,72.39 29.21,74.93 31.75,77.47 34.29,77.47 R22.1 38.1,68.58 v38.1,66.04 38.1,71.12 58.42,71.12 60.96,68.58 67.31,68.58 68.58,69.85 78.74,69.85 | v17.78,44.45 16.51,45.72 R14.1 R13.1 | R101.1 139.7,63.5 139.7,64.77 v138.43,64.77 | 123.19,64.77 v127,64.77 130.81,64.77 | 123.19,64.77 121.92,64.77 119.38,62.23 | 119.38,62.23 119.38,57.15 116.84,53.34 R73.2 | Q3.C R37.1 46.99,59.69 v46.99,66.04 | R100.1 148.59,77.47 v151.13,77.47 152.4,76.2 156.21,76.2 157.48,77.47 157.48,83.82 156.21,83.82 | R101.1 140.97,66.04 v151.13,66.04 161.29,66.04 163.83,63.5 163.83,55.88 R120.2 | R60.2 97.79,106.68 105.41,106.68 106.68,107.95 106.68,111.76 107.95,113.03 110.49,113.03 v111.76,111.76 111.76,109.22 113.03,107.95 121.92,107.95 125.73,104.14 144.78,104.14 148.59,100.33 v166.37,100.33 | 78.74,69.85 83.82,69.85 | 83.82,69.85 86.36,69.85 v92.71,63.5 | v101.6,63.5 104.14,63.5 104.14,64.77 105.41,66.04 107.95,66.04 111.76,62.23 119.38,62.23 | v166.37,93.98 156.21,93.98 R92.1 157.48,90.17 160.02,87.63 156.21,83.82 | R90.2 152.4,83.82 156.21,83.82 | S1.2 170.18,114.3 171.45,115.57 184.15,115.57 185.42,114.3 D13.C | R46.2 83.82,54.61 83.82,55.88 | 83.82,55.88 Q8.C 83.82,69.85 | JP1.6 v111.76,99.06 | 130.81,64.77 R87.2 | C55.+ v176.53,93.98 D10.A v176.53,100.33 C54.+ D12.C D13.C | Q6.C 62.23,50.8 62.23,54.61 | 62.23,54.61 59.69,54.61 R40.1 | 62.23,54.61 66.04,54.61 | R43.2 66.04,54.61 | 66.04,54.61 78.74,54.61 80.01,55.88 83.82,55.88 | R51.1 78.74,69.85 | R84.1 129.54,54.61 129.54,58.42 130.81,59.69 130.81,64.77 | 123.19,64.77 Q13.C 123.19,54.61 120.65,52.07 120.65,44.45 127,44.45 128.27,43.18 R82.1
  Bottom 0.406: R101.1 142.24,60.96 R104.1 | R125.1 189.23,50.8 190.5,52.07 190.5,72.39 191.77,73.66 191.77,87.63 186.69,92.71 186.69,100.33 D13.C
+5V/1
  Bottom 0.406: R13.2 12.7,49.53 19.05,49.53 20.32,50.8 20.32,52.07 C6.+ 26.67,58.42 31.75,58.42 | 31.75,58.42 Q1.E Q2.E | Q5.E 53.34,49.53 52.07,48.26 46.99,48.26 45.72,49.53 34.29,49.53 31.75,52.07 31.75,58.42
+5V/2
  Bottom 0.406: Q14.E 138.43,50.8 142.24,50.8 143.51,52.07 | 143.51,52.07 C47.+ 143.51,54.61 143.51,60.96 144.78,62.23 R101.2 147.32,62.23 R109.1 Q16.E | Q15.E 143.51,43.18 143.51,52.07
+5V/3
  Bottom 0.406: IC4.13 IC4.14 87.63,106.68 | 87.63,106.68 83.82,106.68 | C26.+ 78.74,95.25 82.55,95.25 83.82,96.52 83.82,106.68 | 83.82,106.68 68.58,106.68 | 68.58,106.68 67.31,106.68 IC3.14 | 45.72,106.68 57.15,106.68 59.69,109.22 C15.+ 62.23,110.49 67.31,110.49 68.58,109.22 68.58,106.68 | IC2.14 45.72,106.68 | 45.72,106.68 41.91,106.68 40.64,105.41 25.4,105.41 IC1.14 | 87.63,106.68 90.17,106.68 R60.1
+5V/4
  Bottom 0.406: Q23.C R125.2 R124.1 177.8,52.07 C60.+
AC  (via drill 0.6)
  Top 0.406: v137.16,93.98 v148.59,93.98
  Bottom 0.406: JP1.16 v137.16,93.98 | v148.59,93.98 154.94,87.63 R93.2
BD
  Bottom 0.406: JP1.12 R68.2
CH
  Bottom 0.406: R35.1 48.26,77.47 49.53,78.74 86.36,78.74 90.17,82.55 90.17,93.98 91.44,95.25 91.44,104.14 92.71,105.41 106.68,105.41 109.22,102.87 118.11,102.87 JP1.11
CPI
  Bottom 0.406: JP1.15 134.62,86.36 137.16,83.82 137.16,73.66 138.43,72.39 138.43,67.31 137.16,66.04 137.16,62.23 139.7,59.69 R102.2
CPII
  Bottom 0.406: JP1.14 133.35,95.25 133.35,86.36 135.89,83.82 135.89,60.96 139.7,57.15 R103.2
CY  (via drill 0.6)
  Top 0.406: v53.34,66.04 v53.34,74.93
  Bottom 0.406: R39.1 v53.34,66.04 | v53.34,74.93 54.61,76.2 86.36,76.2 92.71,82.55 92.71,93.98 93.98,95.25 93.98,102.87 106.68,102.87 109.22,100.33 118.11,100.33 119.38,99.06 JP1.9
GND  (via drill 0.6)
  Top 0.406: v29.21,52.07 v29.21,38.1 | v190.5,82.55 v190.5,96.52 | v87.63,86.36 v99.06,86.36 | v186.69,78.74 v176.53,78.74 | v163.83,78.74 v153.67,78.74 | v142.24,78.74 v132.08,78.74 | v123.19,78.74 v113.03,78.74 | v114.3,99.06 v114.3,111.76
  Bottom 0.406: R12.2 3.81,57.15 | 3.81,57.15 3.81,36.83 29.21,36.83 | 29.21,36.83 55.88,36.83 | 55.88,36.83 58.42,36.83 | 58.42,36.83 60.96,36.83 | 60.96,36.83 78.74,36.83 | 78.74,36.83 88.9,36.83 | 88.9,36.83 110.49,36.83 | 110.49,36.83 118.11,36.83 | 118.11,36.83 123.19,36.83 | 123.19,36.83 125.73,36.83 | 125.73,36.83 133.35,36.83 133.35,34.29 | 133.35,34.29 133.35,16.51 | 133.35,16.51 133.35,10.16 | 133.35,10.16 133.35,1.27 149.86,1.27 | 149.86,1.27 157.48,1.27 | 157.48,1.27 193.04,1.27 193.04,13.97 | 193.04,13.97 193.04,96.52 | 193.04,96.52 193.04,114.3 | 193.04,114.3 193.04,116.84 119.38,116.84 | 119.38,116.84 R63.1 | R16.2 v29.21,52.07 30.48,50.8 | v29.21,38.1 29.21,36.83 | v190.5,96.52 193.04,96.52 | 80.01,86.36 IC4.7 IC4.6 | 80.01,86.36 v87.63,86.36 IC4.8 | v99.06,86.36 99.06,90.17 104.14,90.17 | R64.1 104.14,90.17 | 104.14,90.17 109.22,90.17 109.22,86.36 | 109.22,83.82 109.22,78.74 | R66.1 109.22,83.82 | 109.22,83.82 109.22,86.36 | 109.22,86.36 R65.1 | 80.01,86.36 D7.A R56.1 74.93,86.36 69.85,86.36 | R54.1 69.85,86.36 | 69.85,86.36 59.69,86.36 | 55.88,86.36 38.1,86.36 | IC2.7 38.1,86.36 | 38.1,86.36 16.51,86.36 | 16.51,86.36 IC1.7 | v176.53,78.74 176.53,77.47 173.99,77.47 | 173.99,77.47 173.99,78.74 v163.83,78.74 | v153.67,78.74 v142.24,78.74 | v132.08,78.74 129.54,78.74 C44.1 127,85.09 125.73,83.82 125.73,81.28 v123.19,78.74 | v113.03,78.74 109.22,78.74 | 109.22,78.74 R70.1 | 149.86,1.27 C67.1 C68.- | R136.1 157.48,1.27 | IC6.4 142.24,10.16 135.89,10.16 | 135.89,10.16 133.35,10.16 | 133.35,16.51 IC6.2 143.51,24.13 R134.1 | C15.- 63.5,106.68 58.42,106.68 C14.2 55.88,90.17 55.88,86.36 | 55.88,86.36 59.69,86.36 | 59.69,86.36 IC3.7 | v114.3,99.06 JP1.7 JP1.8
  Bottom 0.406: v114.3,111.76 119.38,116.84 | Q17.E 146.05,85.09 R91.1 v142.24,78.74 | v142.24,78.74 142.24,68.58 147.32,68.58 C53.- | C55.- 177.8,85.09 Q19.E 180.34,86.36 181.61,85.09 182.88,85.09 R96.2 186.69,86.36 | v186.69,78.74 186.69,86.36 | v190.5,82.55 186.69,86.36 | 142.24,34.29 133.35,34.29 | C52.- 142.24,34.29 | 142.24,34.29 151.13,34.29 | 151.13,34.29 C49.- 144.78,45.72 C47.- | 151.13,34.29 154.94,34.29 C50.- | C50.- R128.1 170.18,35.56 172.72,38.1 R126.2 | R126.2 Q24.E | R126.2 C60.- | C60.- R122.2 | C50.- 160.02,41.91 162.56,44.45 162.56,45.72 C51.1 | R6.1 16.51,86.36 | IC5.4 13.97,57.15 3.81,57.15 | R15.2 C6.- 30.48,50.8 | 30.48,50.8 33.02,48.26 34.29,48.26 | C7.- 34.29,48.26 | 34.29,48.26 43.18,48.26 R20.1 | R20.1 Q4.E | R20.1 C8.- | C17.- 55.88,36.83 | R44.1 58.42,36.83 | C18.- 60.96,36.83 | Q7.E C21.- 76.2,49.53 | 88.9,36.83 Q9.E R74.1 R75.1 R76.1 R77.1 | R49.1 R48.1 76.2,49.53 | 76.2,49.53 76.2,46.99 78.74,44.45 78.74,36.83 | Q12.E 110.49,36.83 | R80.2 118.11,36.83 | C32.1 123.19,36.83 | R81.2 125.73,36.83 | C47.- R108.2 C48.- C47.- | R116.2 170.18,57.15 175.26,52.07 C60.- | VR4.1 178.49,71.12 C57.- R99.2 173.99,74.93 C56.- 173.99,77.47 | R97.2 193.04,114.3 | G1.- 135.89,10.16 | C64.- 179.07,27.94 185.42,21.59 185.42,13.97 193.04,13.97
N$1
  Bottom 0.406: R3.2 21.59,110.49 20.32,109.22 20.32,105.41 IC1.2 IC1.3
N$2
  Bottom 0.406: IC1.6 19.05,91.44 | IC1.9 19.05,91.44 | 19.05,91.44 19.05,87.63 30.48,87.63 R25.2
N$3
  Bottom 0.406: IC1.12 IC1.11 26.67,96.52 R27.2
N$4
  Bottom 0.406: R29.2 34.29,101.6 IC2.2 IC2.3
N$5
  Bottom 0.406: R34.2 52.07,90.17 46.99,90.17 IC2.9 43.18,91.44 41.91,90.17 39.37,90.17 IC2.6
N$6
  Bottom 0.406: IC2.12 IC2.11
N$7
  Bottom 0.406: R2.1 36.83,109.22 24.13,109.22 21.59,106.68 21.59,99.06 | 21.59,99.06 21.59,96.52 IC1.10 26.67,91.44 C12.1 | TP3.P$1 21.59,99.06
N$8
  Bottom 0.406: R4.1 R3.1 16.51,110.49 12.7,106.68 C1.2
N$9
  Bottom 0.406: IC1.4 12.7,92.71 | C1.1 12.7,92.71 | 12.7,92.71 11.43,92.71 TP1.P$1 R5.2
N$10  (via drill 0.6)
  Top 0.406: v40.64,81.28 v40.64,91.44
  Bottom 0.406: v40.64,91.44 40.64,95.25 39.37,96.52 IC2.4 34.29,92.71 C13.1 | R9.1 v40.64,81.28 | v40.64,81.28 43.18,81.28 44.45,80.01 44.45,74.93 45.72,73.66 54.61,73.66 55.88,74.93 86.36,74.93 93.98,82.55 93.98,93.98 95.25,95.25 97.79,95.25 JP1.1 | TP4.P$1 v40.64,81.28
N$11  (via drill 0.6)
  Top 0.406: v21.59,78.74 v21.59,88.9
  Bottom 0.406: R10.1 v21.59,78.74 TP2.P$1 | v21.59,88.9 IC1.8 C11.1
N$12
  Bottom 0.406: R6.2 10.16,88.9 R5.1 | R5.1 5.08,88.9 5.08,91.44 8.89,95.25 8.89,110.49 13.97,115.57 27.94,115.57 29.21,114.3 R1.1 R2.2 | R5.1 C2.2 R9.2 R10.2 11.43,78.74 C3.2
N$13
  Bottom 0.406: R4.2 20.95,113.67 19.05,111.76 19.05,106.68 IC1.1
N$14
  Bottom 0.406: IC1.5 15.24,93.98 13.97,92.71 13.97,90.17 R7.1
N$15
  Bottom 0.406: IC1.13 26.67,101.6 R28.2
N$16
  Bottom 0.406: R8.2 5.08,74.93 6.35,73.66 6.35,66.04 | R11.1 6.35,66.04 | 6.35,66.04 C5.2 11.43,63.5 IC5.2
N$17
  Bottom 0.406: C19.1 63.5,41.91 62.23,43.18 50.8,43.18 46.99,39.37 35.56,39.37 27.94,46.99 10.16,46.99 8.89,48.26 8.89,54.61 10.16,55.88 13.97,55.88 15.24,57.15 15.24,68.58 IC5.1 C4.1 R11.2
N$18
  Bottom 0.406: R12.1 6.35,63.5 C5.1 2.54,64.77 2.54,67.31 C4.2
N$19  (via drill 0.6)
  Top 0.406: v11.43,58.42 v21.59,58.42
  Bottom 0.406: IC5.3 11.43,60.96 v11.43,58.42 | IC5.5 v21.59,58.42 R15.1 19.05,53.34 19.05,50.8 R14.2
N$20
  Bottom 0.406: C2.1 7.62,78.74 R8.1
N$21
  Bottom 0.406: R17.2 C7.+ R18.1 39.37,50.8 46.99,50.8 49.53,53.34 49.53,64.77 52.07,67.31 TP6.P$1 57.15,67.31 R53.1
N$22
  Bottom 0.406: R19.2 R20.2 | R20.2 C8.+ | R20.2 Q3.B R21.1
N$23
  Bottom 0.406: Q4.B R18.2
N$24
  Bottom 0.406: Q4.C R19.1
N$25
  Bottom 0.406: Q2.C R21.2
N$26
  Bottom 0.406: R17.1 Q1.C
N$27
  Bottom 0.406: R22.2 Q1.B 40.64,66.04 40.64,68.58 41.91,69.85 R35.2
N$28
  Bottom 0.406: R16.1 C9.1 34.29,66.04 C10.2
N$29
  Bottom 0.406: C3.1 R24.1
N$30
  Bottom 0.406: C20.1 49.53,44.45 45.72,40.64 36.83,40.64 29.21,48.26 11.43,48.26 10.16,49.53 10.16,53.34 11.43,54.61 19.05,54.61 20.32,55.88 20.32,64.77 IC5.7 R23.2 C10.1
N$31
  Bottom 0.406: IC5.6 C9.2 29.21,63.5 R23.1 29.21,68.58 29.21,69.85 31.75,72.39 R24.2
N$32
  Bottom 0.406: R27.1 C12.2 R28.1
N$33
  Bottom 0.406: R7.2 C11.2 R25.1
N$34
  Bottom 0.406: R29.1 R30.1 C13.2
N$35
  Bottom 0.406: IC2.1 R30.2
N$36
  Bottom 0.406: R32.2 D1.A C14.1 R31.1
N$37
  Bottom 0.406: IC2.5 36.83,93.98 35.56,92.71 35.56,90.17 R26.1
N$38  (via drill 0.6)
  Top 0.406: v63.5,81.28 v63.5,69.85 | v92.71,68.58 v101.6,68.58
  Bottom 0.406: v63.5,81.28 62.23,80.01 50.8,80.01 C16.2 R26.2 | v63.5,69.85 66.04,72.39 88.9,72.39 v92.71,68.58 | v101.6,68.58 109.22,68.58 114.3,73.66 117.42,73.66 VR1.3
N$39  (via drill 0.6)
  Top 0.406: v71.12,101.6 v71.12,114.3
  Bottom 0.406: IC3.9 71.12,91.44 | 71.12,91.44 v71.12,101.6 IC4.2 | v71.12,114.3 49.53,114.3 46.99,111.76 41.91,111.76 R1.2 | R55.1 71.12,90.17 71.12,91.44
N$40
  Bottom 0.406: IC3.4 IC3.13
N$41
  Bottom 0.406: IC4.1 71.12,104.14 69.85,102.87 69.85,95.25 68.58,93.98 IC3.10 IC3.6
N$42
  Bottom 0.406: IC3.5 IC3.12
N$43
  Bottom 0.406: R59.2 D8.C 71.12,105.41 68.58,102.87 60.96,102.87 IC3.1
N$44
  Bottom 0.406: D1.C R32.1 58.42,113.03 67.31,113.03 72.39,107.95 86.36,107.95 90.17,111.76 95.25,111.76 99.06,107.95 104.14,107.95 105.41,109.22 105.41,113.03 106.68,114.3 111.76,114.3 113.03,113.03 113.03,110.49 114.3,109.22 R63.2 135.89,109.22 140.97,114.3 146.05,114.3 148.59,111.76 162.56,111.76 163.83,110.49 S1.6
N$45  (via drill 0.6)
  Top 0.406: v55.88,95.25 v55.88,83.82 | v82.55,82.55 v82.55,92.71
  Bottom 0.406: IC3.3 v55.88,95.25 | v55.88,83.82 68.58,83.82 69.85,85.09 73.66,85.09 73.66,82.55 v82.55,82.55 | v82.55,92.71 86.36,96.52 IC4.11 R61.2
N$47
  Bottom 0.406: D2.C Q6.B R44.2 C18.+
N$48
  Bottom 0.406: D2.A R38.1 50.8,55.88 Q5.C TP8.P$1
N$49
  Bottom 0.406: R43.1 Q7.B C19.2
N$50
  Bottom 0.406: R46.1 C20.2 Q9.B
N$51
  Bottom 0.406: C22.2 C23.2 74.93,67.31 C24.1 78.74,63.5 R50.2 C25.2
N$52
  Bottom 0.406: R31.2 48.26,102.87 48.26,101.6 | IC2.13 48.26,101.6 | 48.26,101.6 48.26,97.79 R33.2
N$53  (via drill 0.6)
  Top 0.406: v104.14,99.06 v104.14,111.76 | v43.18,114.3 v43.18,101.6
  Bottom 0.406: R33.1 48.26,91.44 IC2.10 43.18,96.52 v43.18,101.6 | JP1.3 v104.14,99.06 | v104.14,111.76 99.06,116.84 45.72,116.84 v43.18,114.3
N$54  (via drill 0.6)
  Top 0.406: v66.04,81.28 v66.04,69.85 | v92.71,66.04 v101.6,66.04
  Bottom 0.406: R34.1 53.34,81.28 55.88,81.28 57.15,82.55 64.77,82.55 v66.04,81.28 | v66.04,69.85 67.31,71.12 87.63,71.12 v92.71,66.04 | v101.6,66.04 104.14,66.04 105.41,67.31 110.49,67.31 113.03,69.85 | 113.03,69.85 113.03,70.43 VR1.1 | 113.03,69.85 114.95,69.85 VR1.2
N$55
  Bottom 0.406: R36.2 49.53,68.58 44.45,68.58 43.18,67.31 Q2.B R37.2
N$56
  Bottom 0.406: Q5.B R40.2 R39.2
N$57
  Bottom 0.406: R41.1 R38.2 54.61,50.8 54.61,48.26 C17.+
N$58
  Bottom 0.406: R41.2 60.96,58.42 62.23,59.69 63.5,59.69 | 63.5,59.69 R42.2 | 63.5,59.69 TP7.P$1 68.58,59.69 | 68.58,59.69 D3.A | C22.1 68.58,59.69
N$59
  Bottom 0.406: R42.1 Q6.E 63.5,46.99 64.77,45.72 72.39,45.72 R45.2
N$60
  Bottom 0.406: R45.1 C21.+ 81.28,49.53 R47.1
N$61
  Bottom 0.406: C24.2 R51.2 | R51.2 Q8.B | R51.2 R48.2
N$62
  Bottom 0.406: D5.C D4.C D3.C Q7.C
N$63
  Bottom 0.406: R53.2 67.31,66.04 C23.1 68.58,64.77 71.12,62.23 D4.A
N$64
  Bottom 0.406: D5.A TP5.P$1 72.39,60.96 72.39,63.5 R52.2 71.12,68.58 C25.1
N$65
  Bottom 0.406: C43.1 96.52,92.71 96.52,82.55 93.98,80.01 93.98,62.23 92.71,60.96 Q8.E | R50.1 Q8.E | Q8.E R49.2
N$66
  Bottom 0.406: Q3.E 48.26,66.04 50.8,68.58 58.42,68.58 60.96,66.04 60.96,63.5 64.77,63.5 R52.1
N$67
  Bottom 0.406: D6.A TP9.P$1 | TP9.P$1 R47.2 | TP9.P$1 C30.1
N$68
  Bottom 0.406: Q9.C D6.C
N$69  (via drill 0.6)
  Top 0.406: v87.63,81.28 v99.06,81.28
  Bottom 0.406: v87.63,81.28 86.36,80.01 72.39,80.01 R55.2 R54.2 | v99.06,81.28 99.06,63.5 100.33,62.23 106.68,62.23 107.95,60.96 107.95,50.8 R79.2
N$70
  Bottom 0.406: IC4.5 77.47,93.98 R58.2 R57.1
N$71
  Bottom 0.406: R58.1 R56.2 D7.C C26.-
N$72  (via drill 0.6)
  Top 0.406: v82.55,97.79 v82.55,111.76 | v101.6,99.06 v101.6,111.76
  Bottom 0.406: R57.2 D8.A 74.93,99.06 77.47,99.06 IC4.4 81.28,96.52 v82.55,97.79 | v82.55,111.76 85.09,114.3 99.06,114.3 v101.6,111.76 | JP1.2 v101.6,99.06
N$73
  Bottom 0.406: R69.1 C38.2 Q10.B
N$74
  Bottom 0.406: R59.1 78.74,99.06 IC4.3
N$75
  Bottom 0.406: R62.2 R61.1 C27.1
N$76
  Bottom 0.406: R62.1 89.53,95.89 89.53,93.34 IC4.9
N$77  (via drill 0.6)
  Top 0.406: v85.09,99.06 v85.09,88.9
  Bottom 0.406: v85.09,99.06 IC4.12 C27.2 | v85.09,88.9 85.09,91.44 IC4.10
N$78
  Bottom 0.406: Q10.E R70.2
N$79
  Bottom 0.406: R69.2 104.14,78.74 Q10.C 106.68,74.93 116.84,74.93 | 116.84,74.93 116.84,88.9 C41.2 | 116.84,74.93 119.38,74.93 120.65,73.66 129.54,73.66 R87.1 129.54,74.93 C45.1
N$80
  Bottom 0.406: R66.2 C39.2 107.95,80.01 107.95,77.47 C38.1 114.3,76.2 115.57,77.47 115.57,86.36 R67.1
N$81
  Bottom 0.406: C44.2 R68.1 R67.2 119.38,76.2 120.65,74.93 C46.1
N$82
  Bottom 0.406: C31.2 R78.1 105.41,49.53 Q11.B
N$83
  Bottom 0.406: C35.2 104.14,57.15 104.14,54.61 99.06,54.61 96.52,57.15 93.98,57.15 93.98,53.34 96.52,50.8 C29.2 R76.2 101.6,43.18 C31.1
N$84
  Bottom 0.406: C28.1 91.44,52.07 C29.1 92.71,49.53 R75.2
N$85
  Bottom 0.406: C40.1 104.14,86.36 R65.2 C41.1
N$86  (via drill 0.6)
  Top 0.406: v114.3,50.8 v125.73,50.8 | v134.62,55.88 v146.05,55.88
  Bottom 0.406: Q12.C 113.03,49.53 v114.3,50.8 | C32.2 123.19,48.26 v125.73,50.8 D9.C 130.81,48.26 132.08,49.53 132.08,55.88 v134.62,55.88 | v146.05,55.88 146.05,52.07 147.32,50.8 154.94,50.8 D15.C D14.C
N$87
  Bottom 0.406: C42.2 127,90.17 129.54,87.63 R89.1
N$88
  Bottom 0.406: C37.1 Q13.E 120.65,54.61 119.38,53.34 119.38,46.99 R80.1
N$89
  Bottom 0.406: R64.2 C40.2 C39.1
N$90
  Bottom 0.406: R71.2 C34.1
N$91
  Bottom 0.406: R79.1 Q12.B
N$92
  Bottom 0.406: C36.1 R72.1
N$93
  Bottom 0.406: R98.1 C56.+
N$94
  Bottom 0.406: C42.1 113.03,91.44 97.79,91.44 97.79,63.5 92.71,58.42 88.9,58.42 C30.2 91.44,49.53 R74.2
N$95
  Bottom 0.406: R77.2 Q11.E
N$96
  Bottom 0.406: C28.2 97.79,53.34 102.87,53.34 | 102.87,53.34 Q11.C R78.2 | 102.87,53.34 R73.1 C34.2
N$97  (via drill 0.6)
  Top 0.406: v124.46,67.31 v134.62,67.31
  Bottom 0.406: VR2.1 134.62,71.7 v134.62,67.31 134.62,60.96 R85.2 | R71.1 C36.2 116.84,67.31 v124.46,67.31 C46.2 R86.1
N$98
  Bottom 0.406: JP1.17 143.51,92.71 Q17.C
N$99
  Bottom 0.406: Q13.B 121.92,52.07 121.92,45.72 124.46,45.72 R81.1 127,45.72 C33.1 129.54,44.45 132.08,44.45 133.35,43.18 R82.2
N$100
  Bottom 0.406: R88.2 R89.2 139.7,83.82 139.7,71.78 VR2.3
N$101
  Bottom 0.406: R84.2 R83.1 Q14.B
N$102
  Bottom 0.406: C35.1 109.22,62.23 109.22,52.07 110.49,50.8 111.76,50.8 113.03,52.07 118.11,52.07 118.11,48.26 116.84,48.26 116.84,43.18 127,43.18 128.27,41.91 138.43,41.91 R106.2 138.43,46.99 138.43,48.26 Q14.C
N$103
  Bottom 0.406: R105.1 138.43,45.72 C33.2 TP13.P$1 D9.A
N$104
  Bottom 0.406: C37.2 R85.1
N$105
  Bottom 0.406: R86.2 125.73,76.2 125.73,80.01 127,81.28 C45.2
N$106
  Bottom 0.406: C43.2 125.73,91.44 129.54,91.44 R88.1
N$107
  Bottom 0.406: R91.2 R90.1 143.51,88.9 Q17.B
N$108
  Bottom 0.406: Q18.B R92.2 R93.1
N$109
  Bottom 0.406: Q18.C 166.37,87.63 R94.2
N$110
  Bottom 0.406: R100.2 146.05,72.39 C53.+ 156.21,74.93 158.75,77.47 158.75,83.82 160.02,85.09 Q18.E
N$111
  Bottom 0.406: VR4.3 182.88,70.51 182.88,64.77 180.34,62.23 179.07,63.5 R118.2 175.26,66.04 166.37,66.04 166.37,66.62 VR3.3
N$112  (1 unrouted)
  Bottom 0.406: D13.A R96.1 185.42,90.17 R95.2 Q19.C 179.07,90.17 176.53,87.63 173.99,87.63 173.99,102.87 170.18,106.68 151.13,106.68 151.13,107.95
N$113
  Bottom 0.406: J1.2 146.33,105.13 147.32,104.14 171.45,104.14 172.72,102.87 172.72,85.09 D11.A 173.99,82.55 180.34,82.55 181.61,81.28 181.61,76.2 182.88,74.93 186.69,74.93 189.23,72.39 189.23,52.07 187.96,50.8 187.96,46.99 189.23,45.72 189.23,36.83 187.96,35.56 179.07,35.56 176.53,33.02 144.15,33.02 G1.+
N$114
  Bottom 0.406: Q19.B R95.1 D12.A C54.-
N$115
  Bottom 0.406: R97.1 173.99,114.3 S1.1
N$116
  Bottom 0.406: S1.3 151.59,113.03 J1.1
N$117
  Bottom 0.406: R117.1 170.18,69.85 C57.+ R99.1 R98.2 161.29,76.2 160.02,77.47 160.02,80.01 161.29,81.28 165.1,81.28 R94.1
N$118
  Bottom 0.406: R103.1 R104.2 142.24,39.37 Q15.B
N$119
  Bottom 0.406: R102.1 146.05,58.42 R109.2 Q16.B
N$120
  Bottom 0.406: C52.+ 138.43,38.1 R105.2 R106.1
N$121
  Bottom 0.406: D16.A R107.2 Q15.C
N$122
  Bottom 0.406: Q16.C 153.67,60.96 R110.2
N$123
  Bottom 0.406: R111.2 157.48,58.42 R110.1 153.67,55.88 C48.+ R108.1
N$124
  Bottom 0.406: R107.1 C49.+ R112.2
N$125
  Bottom 0.406: R112.1 R111.1 160.02,58.42 D14.A TP10.P$1 R115.2
N$126
  Bottom 0.406: C63.2 R128.2 C61.1 163.83,45.72 163.83,52.07 R114.1 R115.1
N$127
  Bottom 0.406: D16.C 154.94,36.83 R113.2 157.48,41.91 C50.+
N$128
  Bottom 0.406: TP12.P$1 R113.1 D15.A 157.48,50.8 C51.2 162.56,50.8 R114.2
N$129
  Bottom 0.406: R117.2 170.18,60.32 Q20.B 172.72,57.15 173.99,55.88 179.07,55.88 179.07,59.69 Q21.B
N$130  (via drill 0.6)
  Top 0.406: v137.16,67.31 v139.7,67.31
  Bottom 0.406: VR2.2 v137.16,67.31 | v139.7,67.31 161.29,67.31 R116.1 | C59.2 166.37,55.88 165.1,55.88 165.1,60.96 R116.1 | R116.1 167.64,63.5 R118.1 Q21.E 172.72,60.32 Q20.C
N$131
  Bottom 0.406: Q20.E 175.26,60.32 Q21.C 175.26,63.5 173.99,64.77 165.72,64.77 VR3.2 VR3.1
N$132
  Bottom 0.406: R119.1 180.34,66.04 181.61,67.31 VR4.2 181.61,72.39 TP?2.P$1
N$133
  Bottom 0.406: R127.1 C61.2 170.18,44.45 Q24.C | Q24.C R120.1 | Q24.C R121.2 TP?1.P$1
N$134
  Bottom 0.406: R122.1 Q22.E
N$135
  Bottom 0.406: R123.1 Q22.C R124.2 Q23.B 185.42,45.72 TP15.P$1
N$137
  Bottom 0.406: Q22.B R123.2 186.69,62.23 C58.+
N$138
  Bottom 0.406: Q23.E R126.1 177.8,44.45 C62.+ TP16.P$1
N$139
  Bottom 0.406: C68.+ 147.32,10.16 147.32,12.7 IC6.7
N$140
  Bottom 0.406: C63.1 167.64,38.1 R127.2 167.64,43.18 167.64,44.45 Q24.B
N$141
  Bottom 0.406: C58.- R119.2
N$142
  Bottom 0.406: C59.1 170.18,52.07 R121.1
N$143
  Bottom 0.406: R129.1 161.29,34.29 172.72,34.29 C62.-
N$144
  Bottom 0.406: C66.1 R129.2
N$145
  Bottom 0.406: IC6.6 153.67,16.51 153.67,20.32 152.4,21.59 152.4,24.13 154.94,26.67 161.29,26.67 R130.2 C64.+
N$146
  Bottom 0.406: R135.2 149.86,10.16 IC6.5 152.4,11.43 154.94,13.97 154.94,21.59 C69.+
N$148
  Bottom 0.406: R132.1 R131.1 C69.-
N$149
  Bottom 0.406: IC6.3 147.32,17.78 147.32,21.59 R134.2 R133.2
N$150
  Bottom 0.406: R133.1 C66.2
N$151
  Bottom 0.406: C67.2 R135.1
OH
  Bottom 0.406: R36.1 50.8,77.47 86.36,77.47 91.44,82.55 91.44,93.98 92.71,95.25 92.71,104.14 106.68,104.14 109.22,101.6 118.11,101.6 121.92,97.79 JP1.10
SD
  Bottom 0.406: JP1.13 132.08,93.98 132.08,86.36 134.62,83.82 134.62,74.93 | 134.62,74.93 134.62,73.66 132.08,71.12 132.08,59.69 130.81,58.42 130.81,52.07 129.54,50.8 R83.2 | R72.2 118.11,66.04 128.27,66.04 129.54,67.31 129.54,71.12 133.35,74.93 134.62,74.93
TEMPO  (via drill 0.6)  (1 unrouted)
  Top 0.406: v43.18,88.9 v43.18,78.74
  Bottom 0.406: IC2.8 C16.1 | v43.18,78.74 43.18,73.66 44.45,72.39 54.61,72.39 55.88,73.66 86.36,73.66 95.25,82.55 95.25,93.98 106.68,93.98 JP1.4

### Text on the board
Top: Q20/Q21 swap corrected